# Altium schematic sheet SSD1306.SchDoc
size A4; SheetNumber: 3; SheetTotal: 5
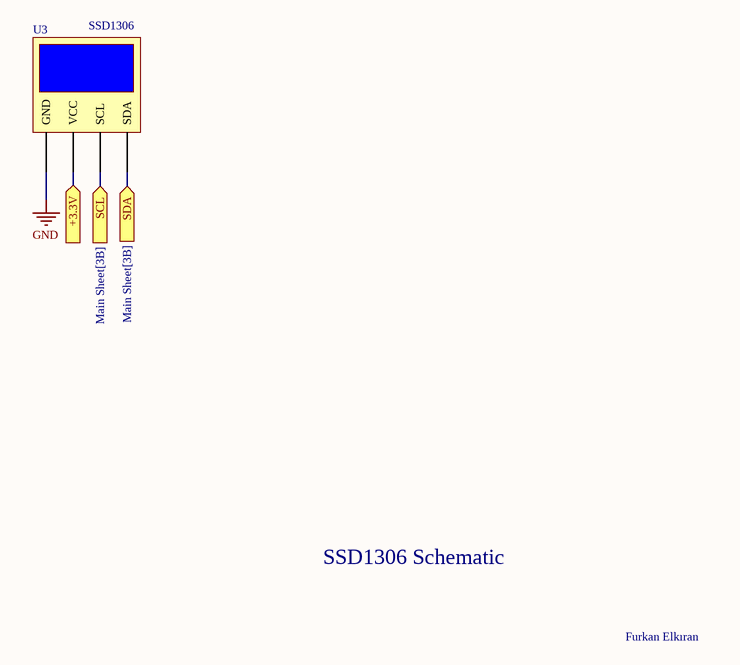
[diagram p0: SSD1306.SchDoc]

## Parts
U3  SSD1306  [SSD1306]

## Ports
+3.3V (in, see Main Sheet[3B], ESP32-S3[1A], Power[4B]), SCL (in, see Main Sheet[3B]), SDA (in, see Main Sheet[3B])

## Nets
GND: U3.0(GND)
+3.3V: U3.1(VCC) ; port +3.3V
SCL: U3.2(SCL) ; port SCL
SDA: U3.3(SDA) ; port SDA

## Notes on the sheet
- SSD1306 Schematic
- Furkan Elkıran

## Library data of the parts
U3 = SSD1306: SSD1306 128x64 0.96 inch OLED Display